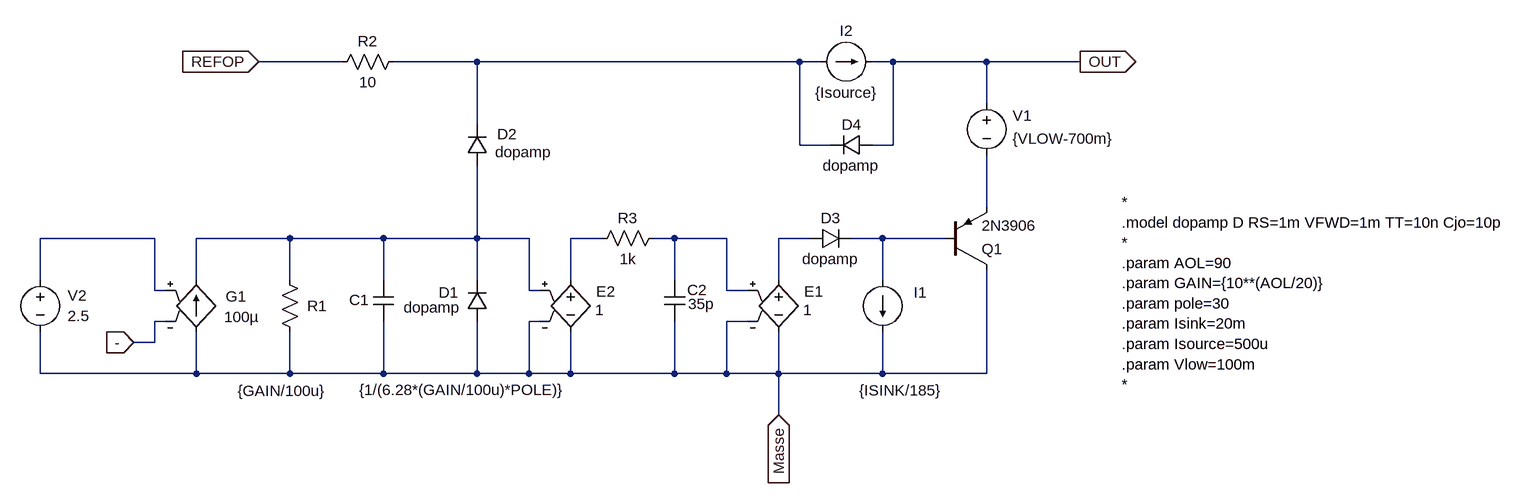
[diagram p0: schematic op_amp_384x.asc]
op_amp_384x.asc, the LTspice schematic file:
Version 4.1
SHEET 1 1932 680
WIRE 96 -224 -32 -224
WIRE 304 -224 176 -224
WIRE 800 -224 304 -224
WIRE 832 -224 800 -224
WIRE 944 -224 912 -224
WIRE 1088 -224 944 -224
WIRE 1232 -224 1088 -224
WIRE 1088 -160 1088 -224
WIRE 304 -128 304 -224
WIRE 800 -96 800 -224
WIRE 848 -96 800 -96
WIRE 944 -96 944 -224
WIRE 944 -96 912 -96
WIRE 1088 0 1088 -80
WIRE -192 48 -368 48
WIRE 16 48 -128 48
WIRE 160 48 16 48
WIRE 304 48 304 -64
WIRE 304 48 160 48
WIRE 384 48 304 48
WIRE 496 48 448 48
WIRE 608 48 576 48
WIRE 688 48 608 48
WIRE 816 48 768 48
WIRE 928 48 880 48
WIRE 1024 48 928 48
WIRE -368 112 -368 48
WIRE -128 112 -128 48
WIRE 16 112 16 48
WIRE 160 112 160 48
WIRE 304 112 304 48
WIRE 448 112 448 48
WIRE 608 112 608 48
WIRE 768 112 768 48
WIRE 928 112 928 48
WIRE -192 128 -192 48
WIRE -176 128 -192 128
WIRE 384 128 384 48
WIRE 400 128 384 128
WIRE 688 128 688 48
WIRE 720 128 688 128
WIRE -176 176 -192 176
WIRE 400 176 384 176
WIRE 720 176 688 176
WIRE -192 208 -192 176
WIRE -192 208 -224 208
WIRE -368 256 -368 192
WIRE -128 256 -128 192
WIRE -128 256 -368 256
WIRE 16 256 16 192
WIRE 16 256 -128 256
WIRE 160 256 160 176
WIRE 160 256 16 256
WIRE 304 256 304 176
WIRE 304 256 160 256
WIRE 384 256 384 176
WIRE 384 256 304 256
WIRE 448 256 448 192
WIRE 448 256 384 256
WIRE 608 256 608 176
WIRE 608 256 448 256
WIRE 688 256 688 176
WIRE 688 256 608 256
WIRE 768 256 768 192
WIRE 768 256 688 256
WIRE 928 256 928 192
WIRE 928 256 768 256
WIRE 1088 256 1088 96
WIRE 1088 256 928 256
WIRE 768 320 768 256
FLAG -224 208 -
IOPIN -224 208 In
FLAG 1232 -224 OUT
IOPIN 1232 -224 Out
FLAG 768 320 Masse
IOPIN 768 320 In
FLAG -32 -224 REFOP
IOPIN -32 -224 In
DATAFLAG 1088 -16 ""
SYMBOL g -128 96 R0
WINDOW 0 45 41 Left 2
WINDOW 3 43 73 Left 2
SYMATTR InstName G1
SYMATTR Value 100µ
SYMBOL res 0 96 R0
WINDOW 0 43 56 Left 2
WINDOW 3 -64 187 Left 2
SYMATTR InstName R1
SYMATTR Value {GAIN/100u}
SYMBOL cap 144 112 R0
WINDOW 0 -37 31 Left 2
WINDOW 3 -21 169 Left 2
SYMATTR InstName C1
SYMATTR Value {1/(6.28*(GAIN/100u)*POLE)}
SYMBOL diode 320 176 R180
WINDOW 0 44 45 Left 2
WINDOW 3 41 22 Left 2
SYMATTR InstName D1
SYMATTR Value dopamp
SYMBOL e 768 96 R0
WINDOW 0 39 34 Left 2
WINDOW 3 38 62 Left 2
SYMATTR InstName E1
SYMATTR Value 1
SYMBOL diode 816 64 R270
WINDOW 0 32 32 VTop 2
WINDOW 3 0 32 VBottom 2
SYMATTR InstName D3
SYMATTR Value dopamp
SYMBOL current 928 112 R0
WINDOW 0 48 19 Left 2
WINDOW 3 -36 170 Left 2
SYMATTR InstName I1
SYMATTR Value {ISINK/185}
SYMBOL pnp 1024 96 M180
SYMATTR InstName Q1
SYMATTR Value 2N3906
SYMBOL voltage 1088 -176 R0
WINDOW 0 40 35 Left 2
WINDOW 3 40 70 Left 2
SYMATTR InstName V1
SYMATTR Value {VLOW-700m}
SYMBOL current 832 -224 R270
WINDOW 0 32 40 VTop 2
WINDOW 3 -32 40 VBottom 2
SYMATTR InstName I2
SYMATTR Value {Isource}
SYMBOL diode 912 -80 M270
WINDOW 0 32 32 VTop 2
WINDOW 3 0 32 VBottom 2
SYMATTR InstName D4
SYMATTR Value dopamp
SYMBOL diode 288 -64 M180
WINDOW 0 47 49 Left 2
WINDOW 3 44 21 Left 2
SYMATTR InstName D2
SYMATTR Value dopamp
SYMBOL res 192 -240 R90
WINDOW 0 0 56 VBottom 2
WINDOW 3 32 56 VTop 2
SYMATTR InstName R2
SYMATTR Value 10
SYMBOL e 448 96 R0
WINDOW 0 39 34 Left 2
WINDOW 3 38 62 Left 2
SYMATTR InstName E2
SYMATTR Value 1
SYMBOL res 592 32 R90
WINDOW 0 0 56 VBottom 2
WINDOW 3 32 56 VTop 2
SYMATTR InstName R3
SYMATTR Value 1k
SYMBOL cap 592 112 R0
WINDOW 0 35 15 Left 2
WINDOW 3 37 37 Left 2
SYMATTR InstName C2
SYMATTR Value 35p
SYMBOL voltage -368 96 R0
WINDOW 0 42 40 Left 2
WINDOW 3 42 71 Left 2
WINDOW 123 0 0 Left 0
WINDOW 39 0 0 Left 0
SYMATTR InstName V2
SYMATTR Value 2.5
TEXT 1296 -8 Left 2 !*\n.model dopamp D RS=1m VFWD=1m TT=10n Cjo=10p\n*\n.param AOL=90\n.param GAIN={10**(AOL/20)}\n.param pole=30\n.param Isink=20m\n.param Isource=500u\n.param Vlow=100m\n*

The netlist it stands for:
* op_amp_384x.asc
G1 Masse N004 N003 - 100µ
R1 N004 Masse {GAIN/100u}
C1 N004 Masse {1/(6.28*(GAIN/100u)*POLE)}
D1 Masse N004 dopamp
E1 N007 Masse N006 Masse 1
D3 N007 N008 dopamp
I1 N008 Masse {ISINK/185}
Q1 Masse N008 N002 0 2N3906
V1 OUT N002 {VLOW-700m}
I2 N001 OUT {Isource}
D4 OUT N001 dopamp
D2 N004 N001 dopamp
R2 N001 REFOP 10
E2 N005 Masse N004 Masse 1
R3 N006 N005 1k
C2 N006 Masse 35p
V2 N003 Masse 2.5
.model D D
.lib standard.dio
.model NPN NPN
.model PNP PNP
.lib standard.bjt
*
.model dopamp D RS=1m VFWD=1m TT=10n Cjo=10p
*
.param AOL=90
.param GAIN={10**(AOL/20)}
.param pole=30
.param Isink=20m
.param Isource=500u
.param Vlow=100m
*
.backanno
.end